# EAGLE design untitled (EAGLE 7.7.0)
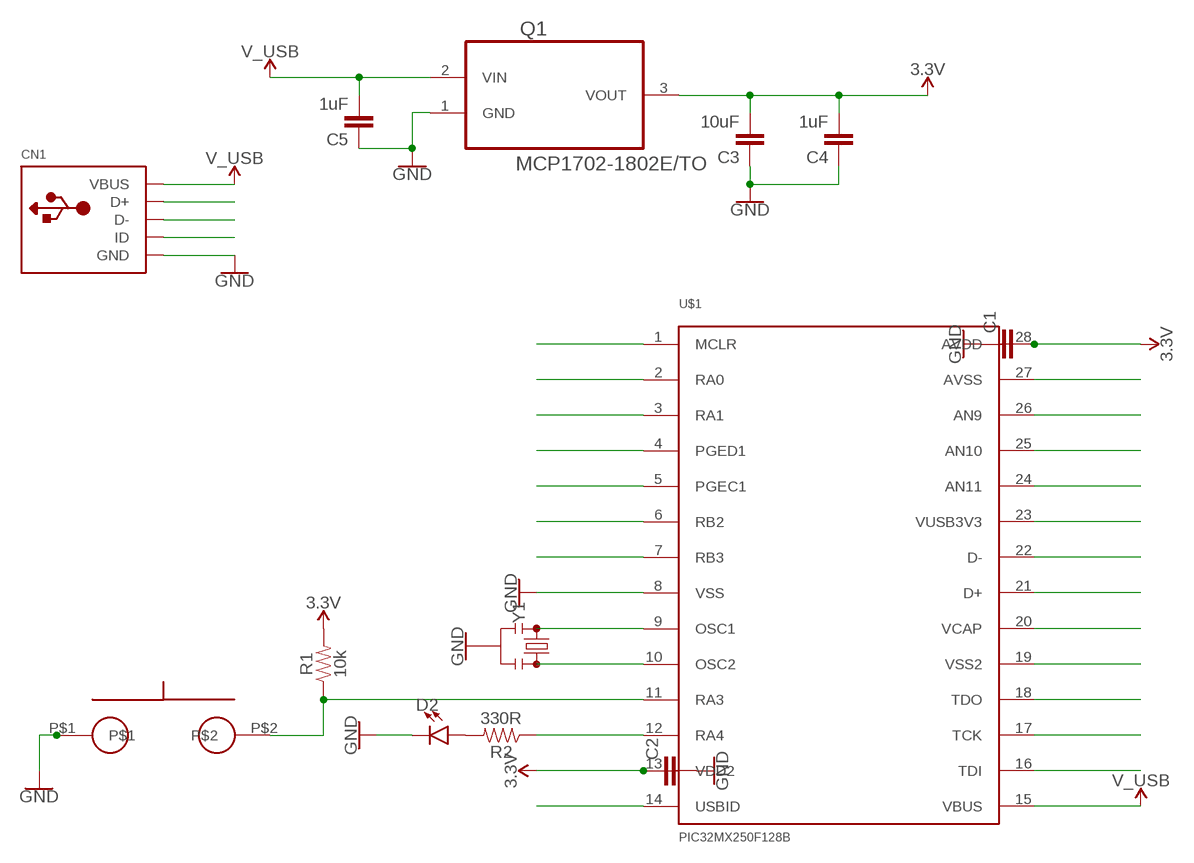
[diagram p0: schematic, sheet 1]

## Parts
C1  CAPVERT_CAP  [PTH_VERT_CAP]
C2  CAPVERT_CAP  [PTH_VERT_CAP]
C3  10uF  CAPVERT_CAP  [PTH_VERT_CAP]
C4  1uF  CAPVERT_CAP  [PTH_VERT_CAP]
C5  1uF  CAPVERT_CAP  [PTH_VERT_CAP]
CN1  USBMINIB  [USB-MINIB]
D2  LED3MM  [LED_3MM]
Q1  MCP1702-1802E/TO  [TO127P254X533-3]
R1  10k  1KOHM-HORIZ-1/4W-5%  [AXIAL-0.3]
R2  330R  1KOHM-HORIZ-1/4W-5%  [AXIAL-0.3]
U$1  PIC32MX250F128B  [DIP28]
U$2  EVQ11  [EVQ11]
Y1  RESONATORPTH-7.6X3.8  [RESONATOR-PTH-7.6X3.8]

## Nets
3.3V: C1.P$2 C2.P$1 C3.P$2 C4.P$2 Q1.3(VOUT) R1.P$2 U$1.13(VDD2) U$1.28(AVDD)
D+: CN1.D+ U$1.21(D+)
D-: CN1.D- U$1.22(D-)
GND: C1.P$1 C2.P$2 C3.P$1 C4.P$1 C5.P$1 CN1.GND D2.K(C) Q1.1(GND) U$1.8(VSS) U$2.P$1 Y1.2
ID: CN1.ID U$1.14(USBID)
MCLR: U$1.1(MCLR)
N$1: D2.A R2.P$2
N$2: U$1.2(RA0)
N$3: U$1.3(RA1)
N$6: U$1.6(RB2)
N$7: U$1.7(RB3)
N$9: U$1.9(OSC1) Y1.1
N$10: U$1.10(OSC2) Y1.3
N$11: R1.P$1 U$1.11(RA3) U$2.P$2
N$12: R2.P$1 U$1.12(RA4)
N$16: U$1.27(AVSS)
N$17: U$1.26(AN9)
N$18: U$1.25(AN10)
N$19: U$1.24(AN11)
N$20: U$1.23(VUSB3V3)
N$23: U$1.20(VCAP)
N$24: U$1.19(VSS2)
N$25: U$1.18(TDO)
N$26: U$1.17(TCK)
N$27: U$1.16(TDI)
PGC: U$1.5(PGEC1)
PGD: U$1.4(PGED1)
V_USB: C5.P$2 CN1.VBUS Q1.2(VIN) U$1.15(VBUS)

## Library data of the parts
C1-C5 = Ilya_Teach:CAP
CN1 = microbuilder:USB: USB Connectors USBMINIB - Surface Mount Female Mini-B USB Connector 4UConnector: 06564
D2 = SparkFun-LED:LED: LED (Generic) Standard schematic elements and footprints for 5mm, 3mm, 1206, and 0603 sized LEDs. Generic LEDs with no color specified.; PROD_ID: DIO-08794
Q1 = Microchip_By_element14_Batch_1:MCP1702-1802E/TO: IC, V REG, LDO, 250MA; MPN: MCP1702-1802E/TO; OC_FARNELL: 1331483; OC_NEWARK: 34M7417; PACKAGE: TO-92; SUPPLIER: Microchip
R1 R2 = SparkFun-Resistors:1KOHM: 1kΩ resistor A resistor is a passive two-terminal electrical component that implements electrical resistance as a circuit element. Resistors act to reduce current flow, and, at the same time, act to lower voltage levels within circuits. - Wikipedia; PROD_ID: RES-08380; VALUE: 1k
U$1 = SparkFun-IC-Microcontroller:PIC32MX250F128B
U$2 = Ilya_Teach:EVQ11
Y1 = SparkFun-Clocks:RESONATOR: Resonators (Generic) Ceramic resonators are clock-generating components, often used to control timing in microcontrollers. They usually have 3 pins: two pins for oscillation, and one pin for ground. Compared to crystals, resonators have worse tolerance, but are usually much cheaper. Plus, they have built-in load capacitors! These devices are used on boards like the Arduino Pro 8MHz <https://www.sparkfun.com/products/11114> and Arduino Pro 16MHz <https://www.sparkfun.com/products/11113>.

## Board
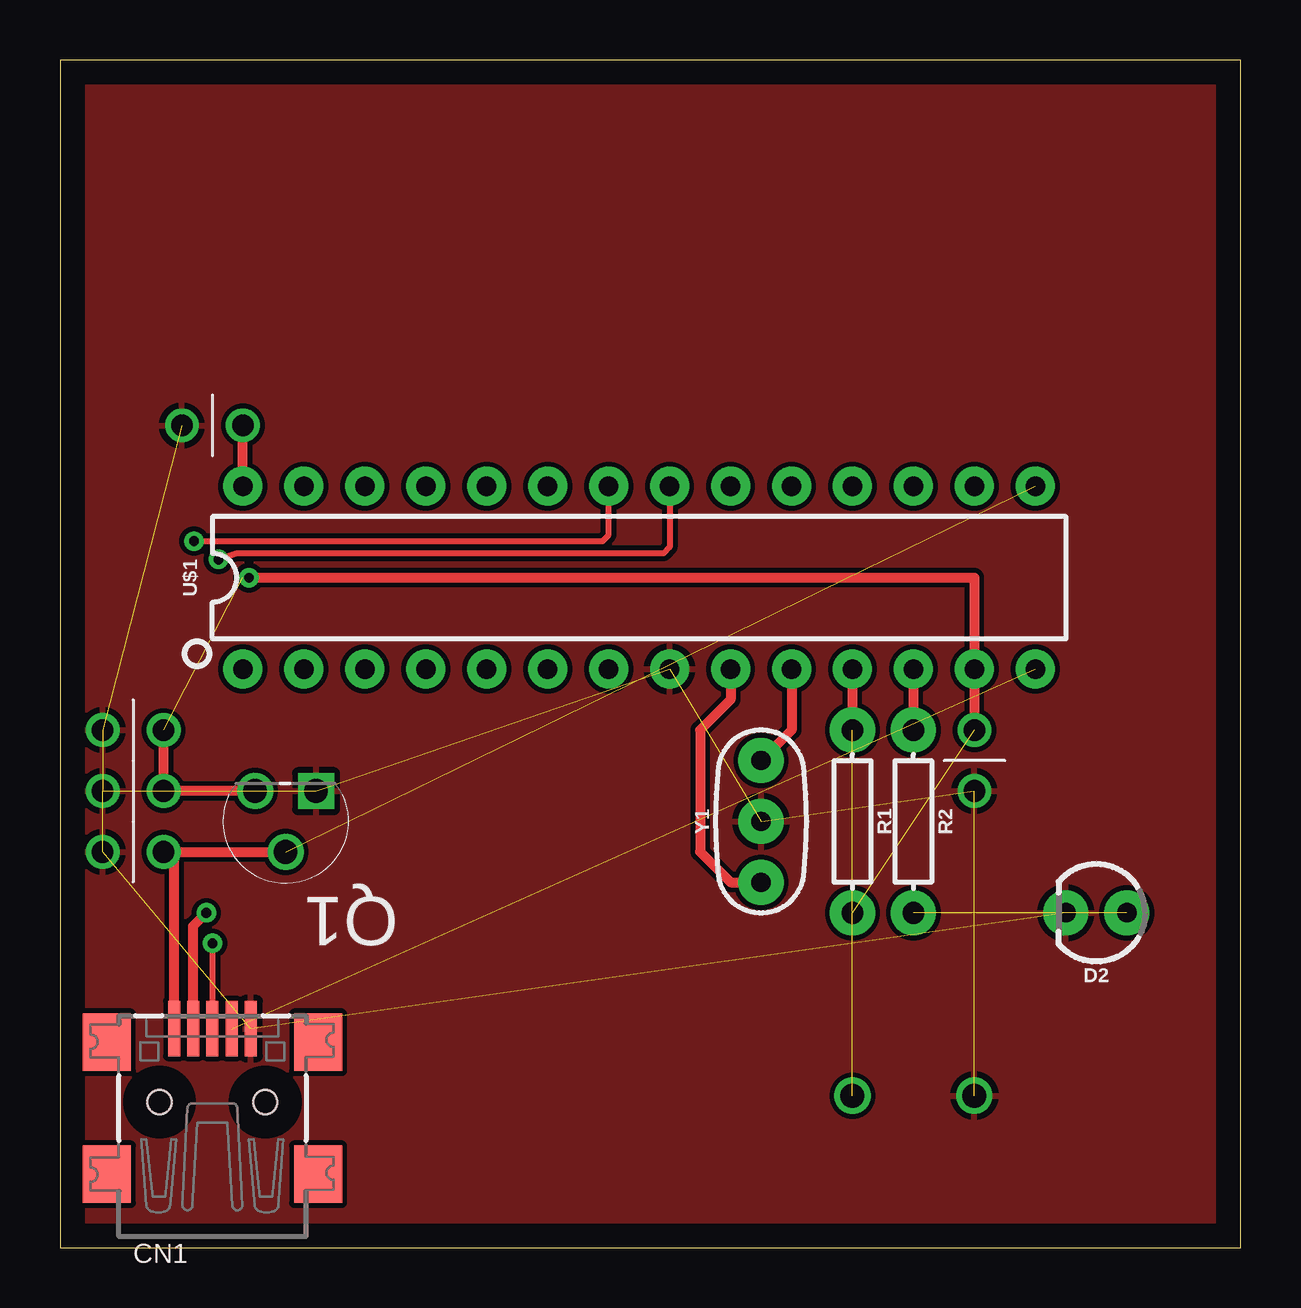
[diagram p1: board, top side]
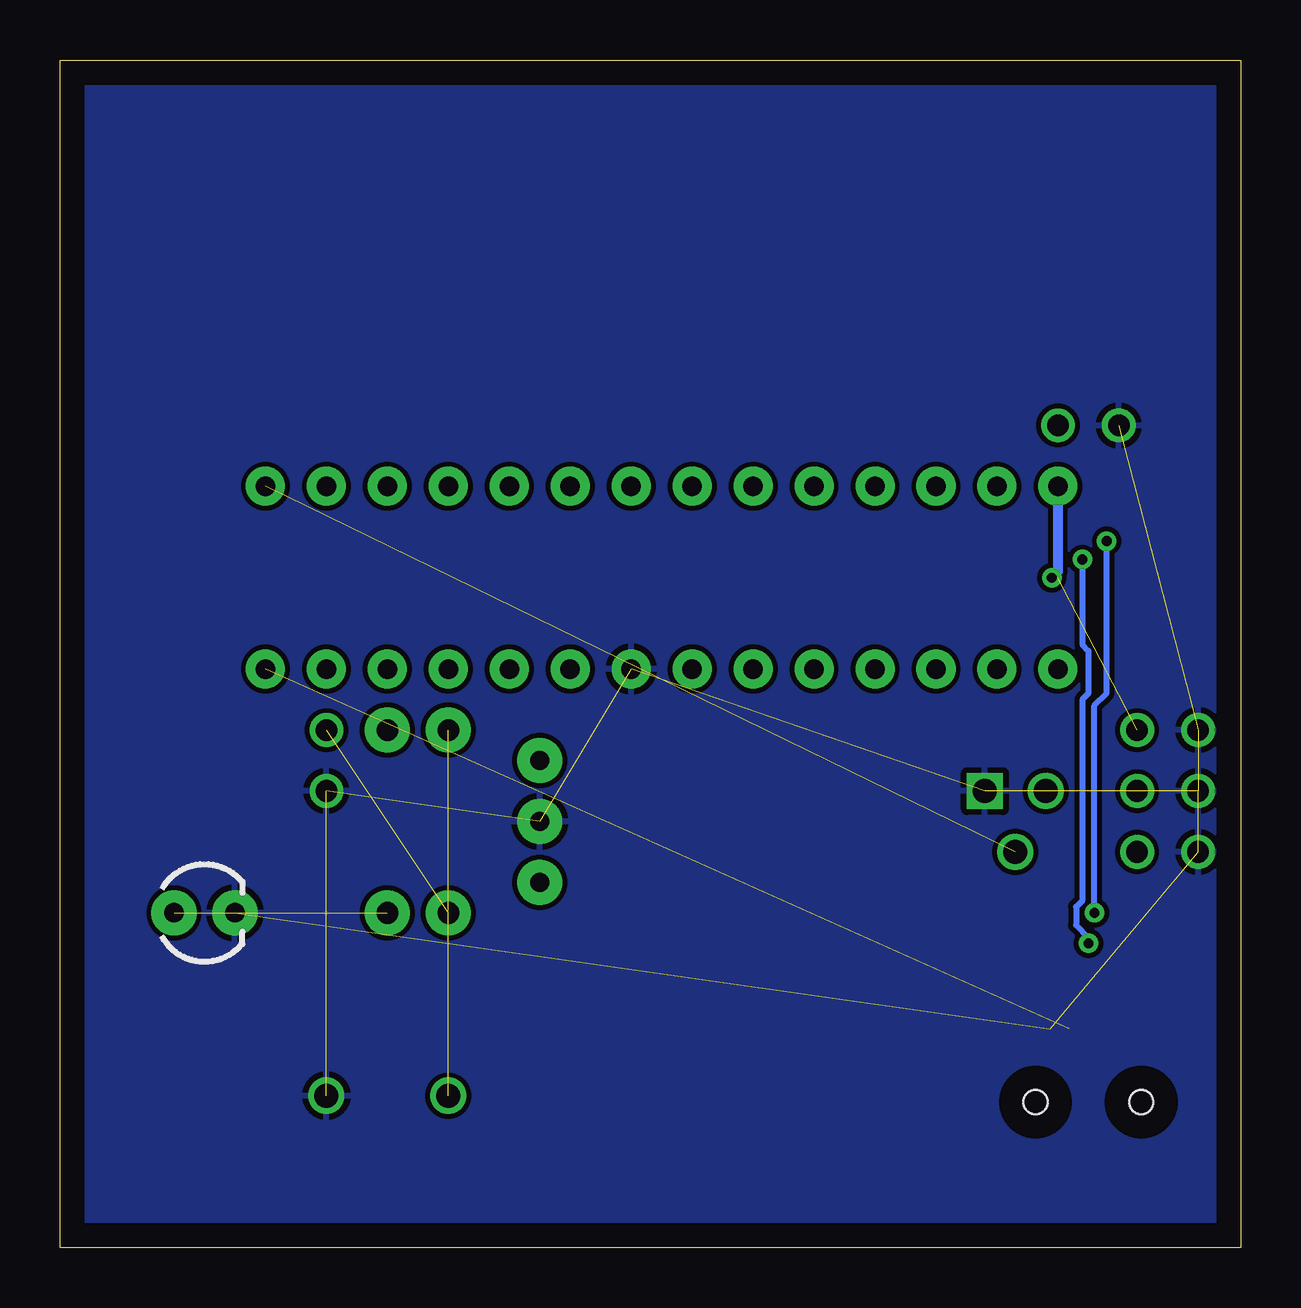
[diagram p2: board, bottom side, seen from below]

Size 49.2 x 49.52 mm. Coordinates in mm from the lower left corner, seen from the top.
Outline: 0,0 49.2,0 49.2,49.52 0,49.52 0,0
Copper layers (1*16): Top 0.035mm / dielectric 1.5mm / Bottom 0.035mm
Design rules "default": minimum track width 10mil, minimum drill 24mil, track to track 8mil, track to pad 8mil, pad to pad 8mil, via to via 8mil, smd to smd 8mil, copper to edge 40mil, drill to drill 8mil, minimum pad ring 10mil, minimum via ring 8mil, stop-mask expansion 4mil, vias tented up to drill 0mil, thermal gap 10mil

### Footprints (pad centres in the part's own frame; a part is rotated, then mirrored left to right if it is on the bottom)
PTH_VERT_CAP = drill 0.9: P$1 -1.27,0; P$2 1.27,0
USB-MINIB = smd 0.5 x 2.308: D+ 0,4.064; D- -0.8,4.064; GND 1.6,4.064; ID 0.8,4.064; VBUS -1.6,4.064 | smd 2 x 2.4: GND1 -4.4,-2; GND2 -4.4,3.5; GND3 4.4,3.5; GND4 4.4,-2 | hole 1: -2.2,1; 2.2,1
LED_3MM = drill 0.813 pad 1.88: A -1.27,0; K 1.27,0
TO127P254X533-3 = drill 0.991 square: 1 -2.54,-2.54 | drill 0.991: 2 -1.27,0; 3 0,-2.54
AXIAL-0.3 = drill 0.9 pad 1.88: P$1 -3.81,0; P$2 3.81,0
DIP28 = drill 0.813 pad 1.626: 1 -16.51,-3.81; 2 -13.97,-3.81; 3 -11.43,-3.81; 4 -8.89,-3.81; 5 -6.35,-3.81; 6 -3.81,-3.81; 7 -1.27,-3.81; 8 1.27,-3.81; 9 3.81,-3.81; 10 6.35,-3.81; 11 8.89,-3.81; 12 11.43,-3.81; 13 13.97,-3.81; 14 16.51,-3.81; 15 16.51,3.81; 16 13.97,3.81; 17 11.43,3.81; 18 8.89,3.81; 19 6.35,3.81; 20 3.81,3.81; 21 1.27,3.81; 22 -1.27,3.81; 23 -3.81,3.81; 24 -6.35,3.81; 25 -8.89,3.81; 26 -11.43,3.81; 27 -13.97,3.81; 28 -16.51,3.81
EVQ11 = drill 1: P$1 0,-2.54; P$2 0,2.54
RESONATOR-PTH-7.6X3.8 = drill 0.8 pad 1.88: 1 -2.54,0; 2 0,0; 3 2.54,0

### Placement (x,y rotation side)
C1  6.35,34.29 0 top
C2  38.1,20.32 270 top
C3  3.05,19.05 0 top
C4  3.05,21.59 0 top
C5  3.05,16.51 0 top
CN1  6.35,5.08 0 top
D2  43.18,13.97 180 top
Q1  8.13,16.51 180 top
R1  33.02,17.78 270 top
R2  35.56,17.78 270 top
U$1  24.13,27.94 0 top
U$2  35.56,6.35 90 top
Y1  29.21,17.78 90 top

### Tracks (layer width: path | path; a pad name or v marks a point on that pad's centre or on a via)
3.3V  (via drill 0.41)  (2 unrouted)
  Top 0.406: Q1.3 C3.P$2 C4.P$2 | U$1.28 C1.P$2 | C2.P$1 U$1.13 38.1,27.94 9.4,27.94 v7.87,27.94 7.62,27.94
  Bottom 0.406: U$1.28 7.62,28.19 v7.87,27.94
D+  (via drill 0.41)
  Top 0.254: U$1.21 25.4,29.21 25.15,28.96 7.37,28.96 v6.6,28.7 | v6.35,12.7 CN1.D+
  Bottom 0.254: v6.6,28.7 6.6,25.15 6.35,24.89 6.35,23.11 6.6,22.86 6.6,14.48 6.86,14.22 6.86,13.46 6.35,12.95 v6.35,12.7
D-  (via drill 0.41)
  Top 0.254: v5.59,29.46 22.61,29.46 22.86,29.72 U$1.22
  Top 0.406: CN1.D- 5.55,13.42 v6.1,13.97
  Bottom 0.254: v6.1,13.97 6.1,22.61 5.59,23.11 v5.59,29.46
GND  (10 unrouted)
  pour Bottom: 0,49.53 49.53,49.53 49.53,0 0,0
  pour Top: 0,49.53 49.53,49.53 49.53,0 0,0
ID  (1 unrouted)
N$1  (1 unrouted)
N$9
  Top 0.406: U$1.9 27.94,22.86 26.67,21.59 26.67,16.51 27.94,15.24 Y1.1
N$10
  Top 0.406: U$1.10 30.48,21.59 Y1.3
N$11  (1 unrouted)
  Top 0.406: U$1.11 R1.P$1
N$12
  Top 0.406: U$1.12 R2.P$1
V_USB  (1 unrouted)
  Top 0.406: CN1.VBUS 4.75,16.18 C5.P$2 Q1.2